# Altium schematic sheet Outputs.SchDoc
size A
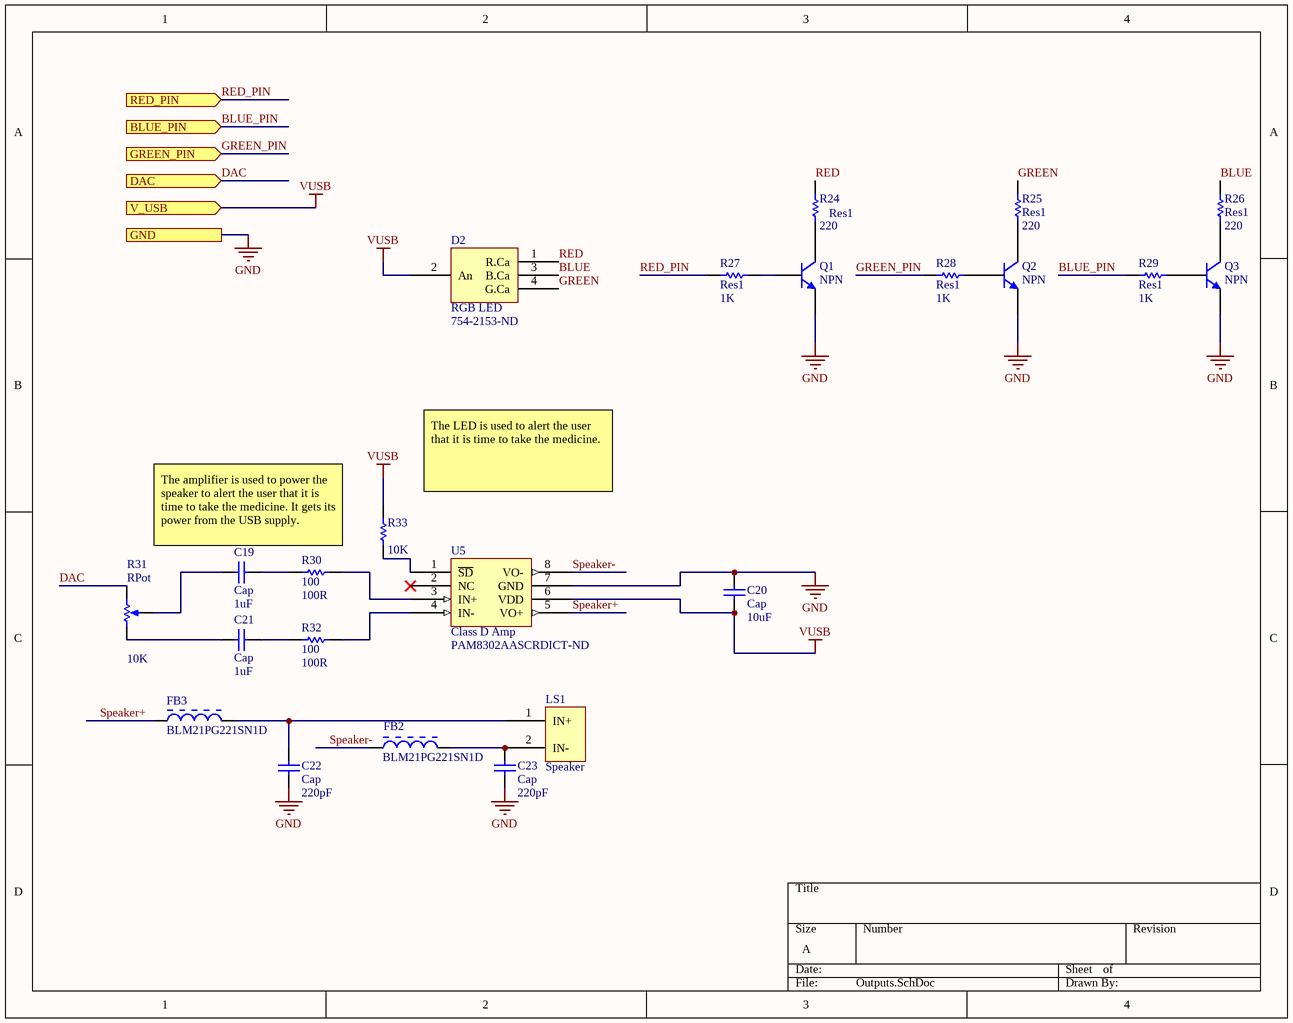
[diagram p0: Outputs.SchDoc]

## Parts
C19  Cap  value 1uF  [C0805]
C20  Cap  value 10uF  [1608[0603]]
C21  Cap  value 1uF  [C0805]
C22  Cap  value 220pF  [1608[0603]]
C23  Cap  value 220pF  [1608[0603]]
D2  RGB LED  Supplier Part Number 1: 754-2153-ND  [WP154A4 LED]
FB2  BLM21PG221SN1D  [MURA-BLM21-B20-CHIP-2_V1]
FB3  BLM21PG221SN1D  [MURA-BLM21-B20-CHIP-2_V1]
LS1  Speaker  [Speaker]
Q1  NPN  [SOT23_L]
Q2  NPN  [SOT23_L]
Q3  NPN  [SOT23_L]
R24  Res1  value 220  [6-0805_L]
R25  Res1  value 220  [6-0805_L]
R26  Res1  value 220  [6-0805_L]
R27  Res1  value 1K  [J1-0603]
R28  Res1  value 1K  [J1-0603]
R29  Res1  value 1K  [J1-0603]
R30  100  value 100R  [6-0805_L]
R31  RPot  value 10K  [VR4]
R32  100  value 100R  [6-0805_L]
R33  value 10K  [J1-0603]
U5  Class D Amp  Supplier Part Number 1: PAM8302AASCRDICT-ND  [PAM8302 SO-8]

## Ports
BLUE_PIN (in), DAC (in), GND, GREEN_PIN (in), RED_PIN (in), V_USB (in)

## Nets
GND: C20.2 C22.2 C23.1 Q1.3(E) Q2.3(E) Q3.3(E) U5.7(GND) ; port GND
VUSB: C20.1 D2.2(An) R33.2 U5.6(VDD) ; port V_USB
BLUE: D2.3(B.Ca) R26.2
BLUE_PIN: R29.1 ; port BLUE_PIN
DAC: R31.2(BOT) ; port DAC
GREEN: D2.4(G.Ca) R25.2
GREEN_PIN: R28.1 ; port GREEN_PIN
RED: D2.1(R.Ca) R24.2
RED_PIN: R27.1 ; port RED_PIN
Speaker+: FB3.1 U5.5(VO+)
Speaker-: FB2.1 U5.8(VO-)
NetC19_1: C19.1 R31.3(TAP)
NetC19_2: C19.2 R30.1
NetC21_1: C21.1 R31.1(TOP)
NetC21_2: C21.2 R32.1
NetC22_1: C22.1 FB3.2 LS1.1(IN+)
NetC23_2: C23.2 FB2.2 LS1.2(IN-)
NetQ1_1: Q1.1(C) R24.1
NetQ1_2: Q1.2(B) R27.2
NetQ2_1: Q2.1(C) R25.1
NetQ2_2: Q2.2(B) R28.2
NetQ3_1: Q3.1(C) R26.1
NetQ3_2: Q3.2(B) R29.2
NetR30_2: R30.2 U5.3(IN+)
NetR32_2: R32.2 U5.4(IN-)
NetR33_1: R33.1 U5.1(~{SD})

Not connected (* = marked no-connect by the designer): U5 2(NC)*

## Notes on the sheet
- (near R33) The LED is used to alert the user that it is time to take the medicine.
- The amplifier is used to power the speaker to alert the user that it is time to take the medicine. It gets its power from the USB supply.

## Library data of the parts
C19-C23 = Cap: Capacitor; Published: 8-Jun-2000; LatestRevisionDate: 17-Jul-2002; LatestRevisionNote: Re-released for DXP Platform.; PackageReference: RAD-0.3; Publisher: Altium Limited; PackageDescription: Radial Cap, Thru-Hole; 2 Leads; 0.3 in Pin Spacing
D2 = WP154A4: RGB LED (THT); Manufacturer: Kingbright; Manufacturer Part Number: WP154A4SEJ3VBDZGC/CA; Supplier 1: Digi-Key; Stock 1: 3880; Pricing 1: 1 = 2.05000, 10 = 1.81400, 25 = 1.34560, 100 = 1.17000, 250 = 1.05300, 500 = 0.93602, 1000 = 0.80439, 2500 = 0.76051, 5000 = 0.73126 (USD)
FB2 FB3 = CMP-0686-00610-2: Chip Ferrite Bead for Power Lines, 220 Ohm, 2000 mA, -55 to 125 degC, 2 x 1.25 x 1.05 mm SMD, Tape and Reel; Manufacturer: Murata; DC Resistance: 0.045 Ohm Max.; Impedance (at 100 MHz): 220 Ohm +/- 25%; Rated Current: 2000 mA; PartNumber: BLM21PG221SN1D; Mounting Technology: Surface Mount; DatasheetVersion: 08/2013; ComponentLink3URL: http://www.murata.com/products/catalog/pdf/c31e.pdf; ComponentLink1URL: http://www.murata.com/; ComponentLink1Description: Manufacturer URL; ComponentLink2URL: http://www.murata.com/products/catalog/pdf/c31e.pdf; PackageDescription: 2-Pin Chip, Body 2 x 1.25 mm; ComponentLink3Description: Package Specification; Operating Temperature Range: -55 to 125 degC; Packing: Tape and Reel; ComponentLink2Description: Datasheet; PackageReference: BLM21_H1050-2
LS1 = Adafruit 3" Speaker: Speaker 3" Diameter 4 Ohm 3 Watt
Q1-Q3 = NPN: NPN Bipolar Transistor; pin to pad: 2>3 3>2; Published: 8-Jun-2000; LatestRevisionDate: 17-Jul-2002; LatestRevisionNote: Re-released for DXP Platform.; PackageReference: TO-226-AA; Publisher: Altium Limited; PackageDescription: TO, Flat Index; 3 In-Line, Axial Leads; Body Dia. 4.8mm; Leads 0.55 x 0.51 mm (max); Code_JEDEC: TO-226-AA
R24-R29 R33 = Res1: Resistor; Published: 8-Jun-2000; LatestRevisionDate: 17-Jul-2002; LatestRevisionNote: Re-released for DXP Platform.; PackageReference: AXIAL-0.3; Publisher: Altium Limited; PackageDescription: Axial Device, Thru-Hole; 2 Leads; 0.3 in Pin Spacing
R30 R32 = Res1: Resistor (100); Published: 8-Jun-2000; LatestRevisionDate: 17-Jul-2002; LatestRevisionNote: Re-released for DXP Platform.; PackageReference: AXIAL-0.3; Publisher: Altium Limited; PackageDescription: Axial Device, Thru-Hole; 2 Leads; 0.3 in Pin Spacing
R31 = RPot: Potentiometer; Sim Note: Enter the Resistance value and the set point into parameter fields.; Set Position: 0.5; Published: 8-Jun-2000; LatestRevisionDate: 17-Jul-2002; LatestRevisionNote: Re-released for DXP Platform.; PackageReference: VR5; Publisher: Altium Limited; PackageDescription: Variable Resistor, Thru-Hole; 3 Leads
U5 = PAM8302A: 2.5W Filterless Class-D Mono Audio Amplifier; Manufacturer: Diodes; Manufacturer Part Number: PAM8302AADCR; Voltage Gain: 24dB; Min Supply Voltage: 2V; Max Supply Voltage: 5.5V; Power Supply Rejection Ratio (PSRR): 50dB; Nominal Supply Current: 8mA; Number of Channels: 1; Operating Supply Current: 4mA; Supply Type: Single; RoHS: Yes; Mount: Surface Mount; Case/Package: SOP; Number of Pins: 8; Min Operating Temperature: -40°C; Max Operating Temperature: 85°C; Package Quantity: 2500; Packaging: Tape and Reel; Max Output Power: 2.5W; Radiation Hardening: No; ComponentLink1URL: http://www.diodes.com/datasheets/PAM8302A.pdf?src-supplier=Avnet; ComponentLink1Description: http://www.diodes.com/datasheets/PAM8302A.pdf?src-supplier=Avnet; ComponentLink2URL: https://www.diodes.com/assets/Datasheets/PAM8302A.pdf?src-supplier=Digi-Key; ComponentLink2Description: https://www.diodes.com/assets/Datasheets/PAM8302A.pdf?src-supplier=Digi-Key; Supplier 1: Digi-Key; Stock 1: 1058; Pricing 1: 1 = 0.63000, 10 = 0.54100, 100 = 0.40380, 500 = 0.31724, 1000 = 0.24514 (USD); Weight: 0.004938oz; Output Power: 2.5W; Lead Free: Lead Free; ComponentLink3URL: http://www.mouser.com/ds/2/115/PAM8302A-247351.pdf?src-supplier=Mouser; ComponentLink3Description: http://www.mouser.com/ds/2/115/PAM8302A-247351.pdf?src-supplier=Mouser